# Altium schematic sheet man_rapido_ejemplo_disp.SchDoc
size A
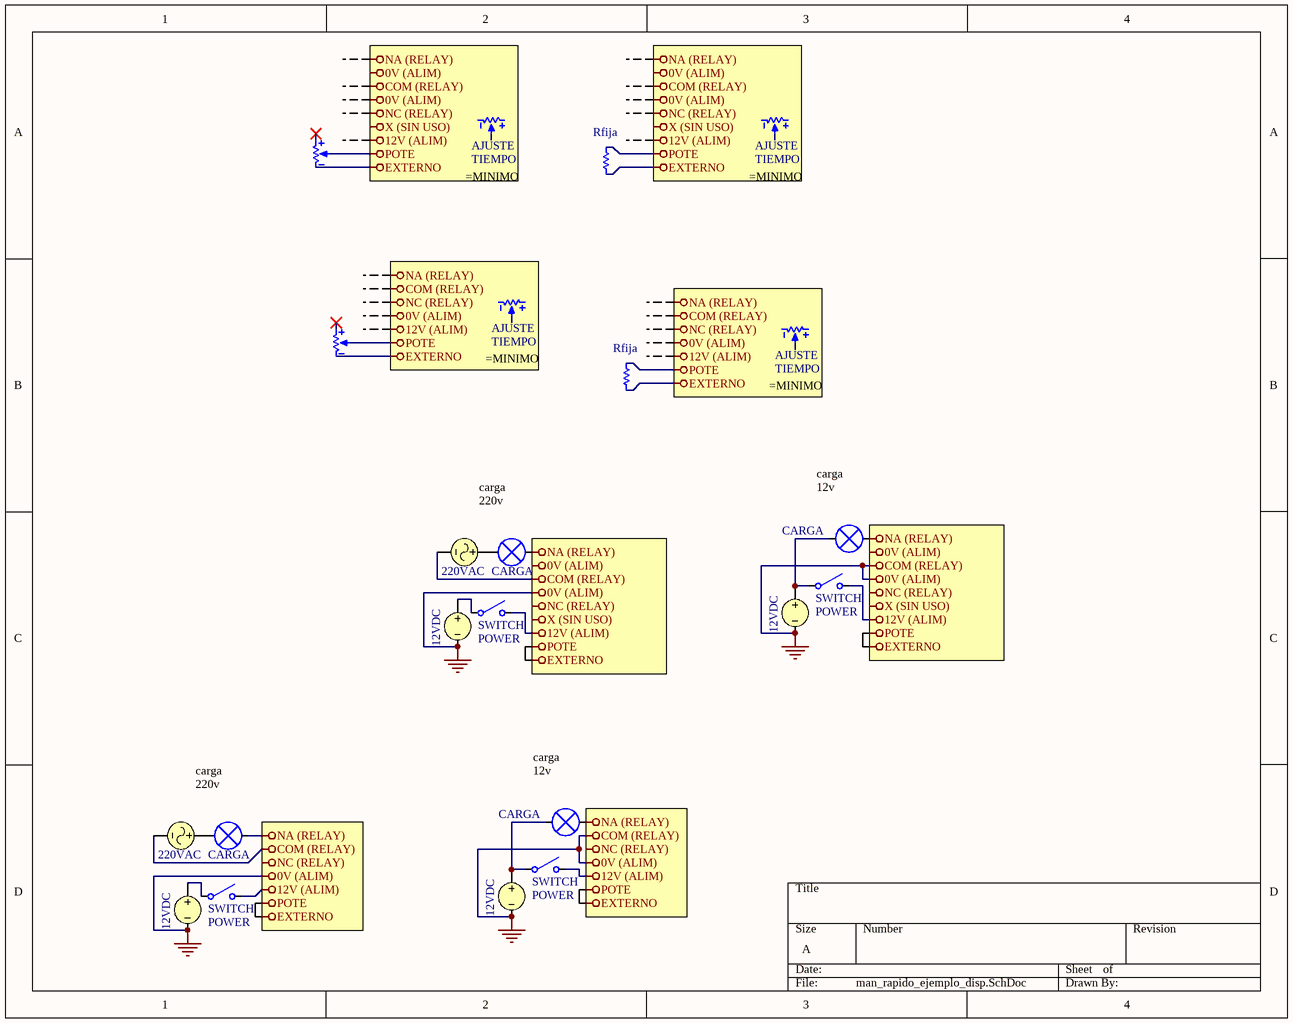
[diagram p0: man_rapido_ejemplo_disp.SchDoc]

## Parts
(Parts that share a designator on the sheet are numbered #1, #2 ... from top to bottom, then left to right.)
CARGA#1  Lamp  [bornera2]  (value not drawn)
CARGA#2  Lamp  [bornera2]  (value not drawn)
CARGA#3  Lamp  [bornera2]  (value not drawn)
CARGA#4  Lamp  [bornera2]  (value not drawn)
R?#1  Set Position: AJUSTE  [conpol4x1]  (hidden comment: RVar)  (part A of 2)
R?#2  Set Position: AJUSTE  [conpol4x1]  (hidden comment: RVar)  (part A of 2)
R?#3  Preset  [PRESET6]  (value not drawn)
R?#4  Set Position: AJUSTE  [conpol4x1]  (hidden comment: RVar)  (part A of 2)
R?#5  Preset  [PRESET6]  (value not drawn)
R?#6  Set Position: AJUSTE  [conpol4x1]  (hidden comment: RVar)  (part A of 2)
Rfija#1  Resistencia 1Kohm 10W  [R_10W]  (value not drawn)
Rfija#2  Resistencia 1Kohm 10W  [R_10W]  (value not drawn)
SWITCH#1  Price: POWER  [PULSADOR200TH]  (hidden comment: SW)
SWITCH#2  Price: POWER  [PULSADOR200TH]  (hidden comment: SW)
SWITCH#3  Price: POWER  [PULSADOR200TH]  (hidden comment: SW)
SWITCH#4  Price: POWER  [PULSADOR200TH]  (hidden comment: SW)
V?#1  220VAC
V?#2  12VDC
V?#3  12VDC
V?#4  220VAC
V?#5  12VDC
V?#6  12VDC

## Nets
0V (ALIM): V?#1.2 V?#4.2  [also labelled COM (RELAY), GND]
12V (ALIM): SWITCH#1.1 SWITCH#2.1 SWITCH#3.1 SWITCH#4.1
EXTERNO: R?#3.3 R?#5.3 Rfija#1.1 Rfija#2.1
NA (RELAY): CARGA#1.2 CARGA#2.2 CARGA#3.2 CARGA#4.2
POTE: R?#3.2 R?#5.2 Rfija#1.2 Rfija#2.2
NetCARGA#1_1: CARGA#1.1 SWITCH#1.2 V?#2.1
NetCARGA#2_1: CARGA#2.1 V?#1.1
NetCARGA#3_1: CARGA#3.1 SWITCH#3.2 V?#5.1
NetCARGA#4_1: CARGA#4.1 V?#4.1
NetSWITCH#2_2: SWITCH#2.2 V?#3.1
NetSWITCH#4_2: SWITCH#4.2 V?#6.1

Not connected (* = marked no-connect by the designer): R?#1 1 2 3; R?#2 1 2 3; R?#3 1*; R?#4 1 2 3; R?#5 1*; R?#6 1 2 3; V?#2 2; V?#3 2; V?#5 2; V?#6 2

## Notes on the sheet
- carga 220v
- (near CARGA#1) carga 12v
- (near CARGA#3) carga 12v
- Labels drawn without touching a wire or pin: 0V (ALIM), 12V (ALIM), COM (RELAY), EXTERNO, NA (RELAY), NC (RELAY), POTE, X (SIN USO)
- (in symbol RVar, part A) TIEMPO

## Library data of the parts
CARGA#1-CARGA#4 = Lamp: Indicator; Price: ?
R?#1 R?#2 R?#4 R?#6 = RVar: Resistencia Variable
R?#3 R?#5 = Preset: Resistencia Variable; Value: 1K
Rfija#1 Rfija#2 = Resistencia 1Kohm 10W: Codigo Elemon: RS3886185; Dolares Elemon: 0.00720; Resistencia: 1K
SWITCH#1-SWITCH#4 = SW: Switch
V?#1 V?#4 = VSIN: Sinusoidal Voltage Source; Note: PCB Footprint - Not required; Published: 8-Jun-2000; LatestRevisionDate: 15-Nov-2004; LatestRevisionNote: Corrected Netlist.; PackageReference: Not Applicable; Publisher: Altium Limited
V?#2 V?#3 V?#5 V?#6 = VSRC: Voltage Source; Note: PCB Footprint - Not required; Published: 8-Jun-2000; LatestRevisionDate: 17-Jul-2002; LatestRevisionNote: Re-released for DXP Platform.; PackageReference: Not Applicable; Publisher: Altium Limited